# Altium schematic sheet Metronome.SchDoc
size 420 x 297 mm; Author: Назаров П.Е.; SheetNumber: 1; SheetTotal: 1; Time: Метроном
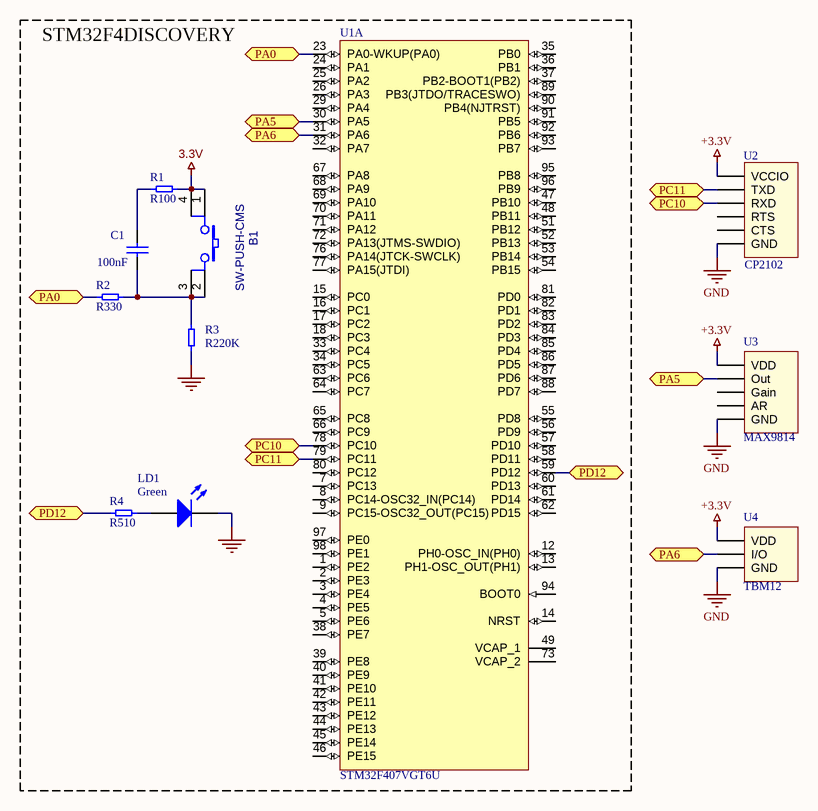
[diagram p0: Metronome.SchDoc]

## Parts
B1  SW-PUSH-CMS  [BP1CMS]
C1  100nF  [RAD-0.3]
LD1  Green  [3.2X1.6X1.1]
R1  R100  [SMD]
R2  R330  [SMD]
R3  R220K  [SMD]
R4  R510  [SMD]
U1  STM32F407VGT6U  [STM-LQFP100_N]  (part A of 2)
U2  CP2102  [CP2102_MD]
U3  MAX9814  [MAX9814]
U4  TBM12  [TBM12]

## Ports
PA0 (bidir), PA5 (bidir), PA6 (bidir), PC10 (bidir), PC11 (bidir), PD12 (bidir)

## Nets
3.3V: B1.1 B1.4 R1.1
+3.3V: U2.0(VCCIO) U3.0(VDD) U4.0(VDD)
GND: LD1.2(K) R3.0 U2.5(GND) U3.4(GND) U4.2(GND)
PA0: R2.0 U1.23(PA0-WKUP(PA0)) ; port PA0
PA5: U1.30(PA5) U3.1(Out) ; port PA5
PA6: U1.31(PA6) U4.1(I/O) ; port PA6
PC10: U1.78(PC10) U2.2(RXD) ; port PC10
PC11: U1.79(PC11) U2.1(TXD) ; port PC11
PD12: R4.0 U1.59(PD12) ; port PD12
NetB1_2: B1.2 B1.3 C1.1 R2.1 R3.1
NetC1_2: C1.2 R1.0
NetLD1_1: LD1.1(A) R4.1

Not connected (* = marked no-connect by the designer): U1 1(PE2) 2(PE3) 3(PE4) 4(PE5) 5(PE6) 7(PC13) 8(PC14-OSC32_IN(PC14)) 9(PC15-OSC32_OUT(PC15)) 12(PH0-OSC_IN(PH0)) 13(PH1-OSC_OUT(PH1)) 14(NRST) 15(PC0) 16(PC1) 17(PC2) 18(PC3) 24(PA1) 25(PA2) 26(PA3) 29(PA4) 32(PA7) 33(PC4) 34(PC5) 35(PB0) 36(PB1) 37(PB2-BOOT1(PB2)) 38(PE7) 39(PE8) 40(PE9) 41(PE10) 42(PE11) 43(PE12) 44(PE13) 45(PE14) 46(PE15) 47(PB10) 48(PB11) 49(VCAP_1) 51(PB12) 52(PB13) 53(PB14) 54(PB15) 55(PD8) 56(PD9) 57(PD10) 58(PD11) 60(PD13) 61(PD14) 62(PD15) 63(PC6) 64(PC7) 65(PC8) 66(PC9) 67(PA8) 68(PA9) 69(PA10) 70(PA11) 71(PA12) 72(PA13(JTMS-SWDIO)) 73(VCAP_2) 76(PA14(JTCK-SWCLK)) 77(PA15(JTDI)) 80(PC12) 81(PD0) 82(PD1) 83(PD2) 84(PD3) 85(PD4) 86(PD5) 87(PD6) 88(PD7) 89(PB3(JTDO/TRACESWO)) 90(PB4(NJTRST)) 91(PB5) 92(PB6) 93(PB7) 94(BOOT0) 95(PB8) 96(PB9) 97(PE0) 98(PE1); U2 3(RTS) 4(CTS); U3 2(Gain) 3(AR)

## Notes on the sheet
- STM32F4DISCOVERY
- THIS DOCUMENT AND THE DATA DISCLOSED HEREIN OR
- HEREWITH IS THE PROPERTY OF ALTIUM LIMITED AND MAY
- DWG NO:
- REVISION
- REV:
- DESCRIPTION
- DATE
- APPROVED
- BE FREELY DISTRIBUTED IN WHOLE. NO RIGHTS ARE
- RESERVED OR EXPRESS OR IMPLIED WARANTEE GIVEN.
- ENG:
- APPROVALS
- PROJECT
- DSN:
- CHK:
- REFERENCE DOCUMENTS
- PROJECT REVISION:
- TITLE
- DOCUMENT REVISION:
- DESIGN ITEM:
- BOM:
- FAB DWG:
- PCB DWG:
- ASSY DWG:
- SCALE:
- A3
- SIZE
- CAGE CODE
- FILE NAME
- DWG NO.
- SHEET
- OF
- REV

## Library data of the parts
B1 = SW-PUSH-CMS: Non-Open Push-Button 0.1A 24V; Manuf_1: FARNELL; Manuf_Part_1: 535-930; Ref St: 9180120; cap_dec: ---
C1 = CAP: Capacitor; Value: 100pF; Published: 8-Jun-2000; Publisher: Altium Limited; LatestRevisionDate: 17-Jul-2002; LatestRevisionNote: Re-released for DXP Platform.; PackageReference: RAD-0.3; PackageDescription: Radial Cap, Thru-Hole; 2 Leads; 0.3 in Pin Spacing
LD1 = LED2: Typical RED, GREEN, YELLOW, AMBER GaAs LED; Published: 8-Jun-2000; Publisher: Altium Limited; LatestRevisionDate: 17-Jul-2002; LatestRevisionNote: Re-released for DXP Platform.; PackageVersion: Feb-2002; PackageReference: 3.2X1.6X1.1; PackageDescription: SM LED; 2 Flat Leads
R1 R3 R4 = R330
U1 = STM32F407VGT6U: ARM Cortex-M4 32-bit MCU+FPU, 210 DMIPS, 1024 kB Flash, 192 kB Internal RAM, 82 I/Os, 100-pin LQFP, -40 to 85 degC, Tray; Manufacturer: STMicroelectronics; D/A Converter: 2x12-bit; FLASH Size (Prog) (kB): 1024; I/Os (High Current): 82; Internal RAM Size (kB): 192; Operating Frequency(F) (Processor speed) (MHz): 168; Supply Voltage(Vcc) max (V): 3.6; Supply Voltage(Vcc) min (V): 1.8; DatasheetVersion: Rev. 4; PackageVersion: Rev. 1, 06/2013; PackageReference: LQFP100; PackageDescription: 100-Pin Low Profile Quad Flat Package, 14 x 14 mm Body, 0.5 mm Pitch; Supplier 1: Mouser; Supplier Part Number 1: N/A; Core: ARM Cortex-M4; Packing: Tray; Mounting Technology: Surface Mount; PartNumber: STM32F407VGT6U; ComponentLink1Description: Manufacturer URL; ComponentLink1URL: http://www.st.com/web/en/home.html; ComponentLink2Description: Datasheet; ComponentLink2URL: http://www.st.com/st-web-ui/static/active/en/resource/technical/document/datasheet/DM00037051.pdf; ComponentLink3Description: Package Specification; ComponentLink3URL: http://www.st.com/st-web-ui/static/active/en/resource/technical/document/data_brief/DM00071938.pdf
U2 = CP2102: UART-USB converter module
U3 = MAX9814: Microphone module. 3.3V - 5V. Output: 2Vpp max
U4 = TBM12: Passive buzzer. 3.3V - 5V